# Altium project UZ_per_cb_upgrade.PrjPcb (part 1 of 3)
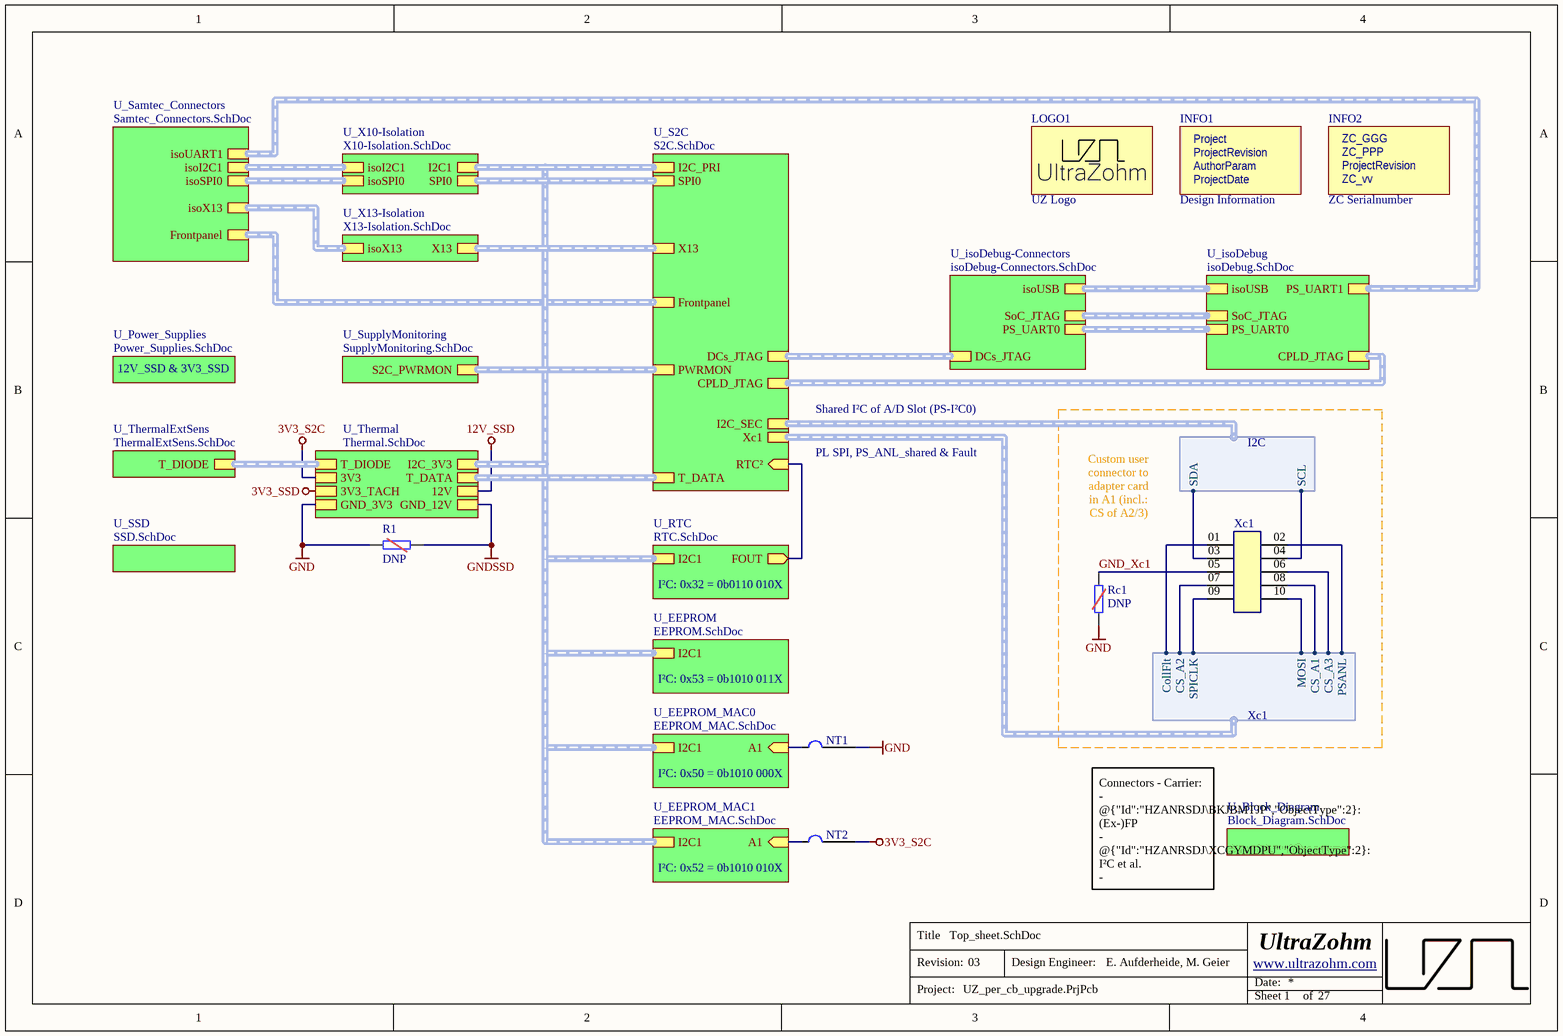
[diagram p0: Top_sheet.SchDoc]
AuthorParam: E. Aufderheide, M. Geier; Project: Rev04UZC_I²C&SSD&S²C; ProjectDate: 05/2025; ProjectRevision: 03; ZC_GGG: 004; ZC_PPP: 003; SheetTotal: 27; Organization: UltraZohm; Website: www.ultrazohm.com
21 sheets, 223 parts. Net scope: hierarchical (ports join the sheet entries above them; power ports are global).
Board file: UZ_per_cb_upgrade.PcbDoc
Sheets:
  Top_sheet.SchDoc
    U_Samtec_Connectors = Samtec_Connectors.SchDoc
    U_RTC = RTC.SchDoc
    U_EEPROM_MAC0 = EEPROM_MAC.SchDoc
    U_EEPROM_MAC1 = EEPROM_MAC.SchDoc
    U_EEPROM = EEPROM.SchDoc
    U_SSD = SSD.SchDoc
    U_Block_Diagram = Block_Diagram.SchDoc
    U_Power_Supplies = Power_Supplies.SchDoc
    U_S2C = S2C.SchDoc
      U_S2C_IOs3V3 = S2C_IOs3V3.SchDoc
        U_S2C_IOs3V3_SelectSPI = S2C_IOs3V3_SelectSPI.SchDoc
      U_S2C_IOs1V8 = S2C_IOs1V8.SchDoc
      U_S2C_IOsVIO = S2C_IOsVIO.SchDoc
      U_S2C_FrontpanelInterface = S2C_FrontpanelInterface.SchDoc
      U_S2C_SelectJTAG = S2C_SelectJTAG.SchDoc
    U_isoDebug-Connectors = isoDebug-Connectors.SchDoc
    U_X10-Isolation = X10-Isolation.SchDoc
    U_X13-Isolation = X13-Isolation.SchDoc
    U_SupplyMonitoring = SupplyMonitoring.SchDoc
    U_ThermalExtSens = ThermalExtSens.SchDoc
  isoDebug-Isolation.SchDoc

## Sheet Top_sheet.SchDoc
size A4; SheetNumber: 1

### Parts
INFO1  Design Information  [Design_info2]  (no BOM)
INFO2  ZC Serialnumber  [ZC-Serial]  (no BOM)
LOGO1  UZ Logo  [UZ_Logo_small]  (no BOM)
NT1  Net Tie 1 to 1  [1_to_1_NetTie_0.1mm]  (value not drawn)  (net tie, no BOM)
NT2  Net Tie 1 to 1  [1_to_1_NetTie_0.1mm]  (value not drawn)  (net tie, no BOM)
R1  DNP  [R_1206_TE-DNP]  (no BOM)
Rc1  DNP  [R_1206_TE-DNP]  (no BOM)
Xc1  PH 0.1" SMD 2x05  [TSM-105-01-L-DV]  (value not drawn)

### Sub-sheets
U_Block_Diagram = Block_Diagram.SchDoc: no entries
U_EEPROM = EEPROM.SchDoc: I2C1 (harness I2C)
U_EEPROM_MAC0 = EEPROM_MAC.SchDoc: I2C1 (harness I2C), A1 (in)
U_EEPROM_MAC1 = EEPROM_MAC.SchDoc: I2C1 (harness I2C), A1 (in)
U_isoDebug = isoDebug.SchDoc (file not in this document): SoC_JTAG (harness JTAG), CPLD_JTAG (harness JTAG), PS_UART0 (harness UART), PS_UART1 (harness UART), isoUSB (harness USB)  | SubSheet_SheetNumber: 20
U_isoDebug-Connectors = isoDebug-Connectors.SchDoc: isoUSB (harness USB), SoC_JTAG (harness JTAG), PS_UART0 (harness UART), DCs_JTAG (harness JTAG)
U_Power_Supplies = Power_Supplies.SchDoc: no entries
U_RTC = RTC.SchDoc: I2C1 (harness I2C), FOUT (out)
U_S2C = S2C.SchDoc: T_DATA (harness T_DATA), PWRMON (harness S2C_PWRMON), CPLD_JTAG (harness JTAG), DCs_JTAG (harness JTAG), I2C_PRI (harness I2C), Frontpanel (harness Frontpanel), SPI0 (harness SPI0), X13 (harness X13), I2C_SEC (harness I2C), Xc1 (harness Xc1), RTC² (in)
U_Samtec_Connectors = Samtec_Connectors.SchDoc: Frontpanel (harness Frontpanel), isoUART1 (harness UART), isoI2C1 (harness I2C), isoX13 (harness X13), isoSPI0 (harness SPI0)
U_SSD = SSD.SchDoc: no entries
U_SupplyMonitoring = SupplyMonitoring.SchDoc: S2C_PWRMON (harness S2C_PWRMON)
U_Thermal = Thermal.SchDoc (file not in this document): I2C_3V3 (harness I2C), T_DIODE (harness T_DIODE), T_DATA (harness T_DATA), 12V, 3V3, 3V3_TACH, GND_3V3, GND_12V  | SubSheet_SheetNumber: 25
U_ThermalExtSens = ThermalExtSens.SchDoc: T_DIODE (harness T_DIODE)
U_X10-Isolation = X10-Isolation.SchDoc: isoI2C1 (harness I2C), isoSPI0 (harness SPI0), I2C1 (harness I2C), SPI0 (harness SPI0)
U_X13-Isolation = X13-Isolation.SchDoc: isoX13 (harness X13), X13 (harness X13)

### Harnesses
I2C: SCL, SDA
Xc1: CollFlt, CS_A2, SPICLK, MOSI, CS_A1, CS_A3, PSANL

### Nets
3V3_S2C: NT2.2 ; sheet U_Thermal/3V3
GND: NT1.2 R1.2 Rc1.2 ; sheet U_Thermal/GND_3V3
GNDSSD: R1.1 ; sheet U_Thermal/GND_12V
EEPROM_MAC_A1-: NT1.1 ; sheet U_EEPROM_MAC0/A1
EEPROM_MAC_A1-: NT2.1 ; sheet U_EEPROM_MAC1/A1  [a separate net that carries the same name]
FOUT: sheet U_RTC/FOUT, sheet U_S2C/RTC²
GND_Xc1: Rc1.1 Xc1.05
Xc1.CollFlt: Xc1.01 ; sheet U_S2C/Xc1.CollFlt
Xc1.CS_A1: Xc1.08 ; sheet U_S2C/Xc1.CS_A1
Xc1.CS_A2: Xc1.07 ; sheet U_S2C/Xc1.CS_A2
Xc1.CS_A3: Xc1.06 ; sheet U_S2C/Xc1.CS_A3
Xc1.MOSI: Xc1.10 ; sheet U_S2C/Xc1.MOSI
Xc1.PSANL: Xc1.02 ; sheet U_S2C/Xc1.PSANL
Xc1.SPICLK: Xc1.09 ; sheet U_S2C/Xc1.SPICLK
NetR31_1: Xc1.04 ; sheet U_S2C/I2C_SEC.SCL
NetR32_1: Xc1.03 ; sheet U_S2C/I2C_SEC.SDA

### Buses and harness runs
harness sheet U_EEPROM/I2C1 = sheet U_EEPROM_MAC0/I2C1 = sheet U_EEPROM_MAC1/I2C1 = sheet U_RTC/I2C1 = sheet U_S2C/I2C_PRI = sheet U_Thermal/I2C_3V3 = sheet U_X10-Isolation/I2C1
harness sheet U_isoDebug-Connectors/DCs_JTAG = sheet U_S2C/DCs_JTAG
harness sheet U_isoDebug-Connectors/isoUSB = sheet U_isoDebug/isoUSB
harness sheet U_isoDebug-Connectors/PS_UART0 = sheet U_isoDebug/PS_UART0
harness sheet U_isoDebug-Connectors/SoC_JTAG = sheet U_isoDebug/SoC_JTAG
harness sheet U_isoDebug/CPLD_JTAG = sheet U_S2C/CPLD_JTAG
harness sheet U_isoDebug/PS_UART1 = sheet U_Samtec_Connectors/isoUART1
harness sheet U_S2C/Frontpanel = sheet U_Samtec_Connectors/Frontpanel
harness sheet U_S2C/PWRMON = sheet U_SupplyMonitoring/S2C_PWRMON
harness sheet U_S2C/SPI0 = sheet U_X10-Isolation/SPI0
harness sheet U_S2C/T_DATA = sheet U_Thermal/T_DATA
harness sheet U_S2C/X13 = sheet U_X13-Isolation/X13
harness sheet U_Samtec_Connectors/isoI2C1 = sheet U_X10-Isolation/isoI2C1
harness sheet U_Samtec_Connectors/isoSPI0 = sheet U_X10-Isolation/isoSPI0
harness sheet U_Samtec_Connectors/isoX13 = sheet U_X13-Isolation/isoX13
harness sheet U_Thermal/T_DIODE = sheet U_ThermalExtSens/T_DIODE

### Notes on the sheet
- 12V_SSD & 3V3_SSD
- Shared I²C of A/D Slot (PS-I²C0)
- PL SPI, PS_ANL_shared & Fault
- Custom user connector to adapter card in A1 (incl.: CS of A2/3)
- I²C: 0x32 = 0b0110 010X
- I²C: 0x53 = 0b1010 011X
- (near NT1) I²C: 0x50 = 0b1010 000X
- (near NT2) I²C: 0x52 = 0b1010 010X
- Connectors - Carrier:
  - @{"Id":"HZANRSDJ\BKJBMTJP","ObjectType":2}: (Ex-)FP
  - @{"Id":"HZANRSDJ\XCGYMDPU","ObjectType":2}: I²C et al.
  - @{"Id":"NFRUWTDK\GEDVIQXD","ObjectType":2}: D5 signals
  - @{"Id":"HZANRSDJ\LVDAVBXZ","ObjectType":2}: isoGPIO
  - 2x JTAG, 2x SATA
  NB: @{"Id":"NFRUWTDK\GEDVIQXD","ObjectType":2} sources
  the local @{"Id":"LAOQKLBU\YLFQDURX","ObjectType":1}!
- Title
- Revision:
- Design Engineer:
- Date:
- Project:
- Sheet
- of
- (in symbol Design Information) Project; ProjectRevision; AuthorParam; ProjectDate
- (in symbol ZC-Serial) ZC_GGG; ZC_PPP; ProjectRevision; ZC_vv

### Library data of the parts
INFO1 = Design Information: Manufacturer: UltraZohm; Created from: MGremer; Manufacturer Part Number: Design Information; PartID: 12; Created On: 03/11/2021 09:04:23; ComponentLink1Description: https://docs.ultrazohm.com/; ComponentLink1URL: homepage; Component Type: Design Information; Last Updated: 15/04/2025 09:29:36; Supplier 1: -; Supplier Part Number 1: -; Type: Design Information; Value: Design Information; Live Cycle Status: 1
INFO2 = ZC-Serial: Manufacturer: UltraZohm; Value: GGG-PPP-VVvv; Created from: FRosner; Manufacturer Part Number: ZC-Serial; PartID: 58; Created On: 15/04/2025 09:17:14; ComponentLink1Description: https://docs.ultrazohm.com/; ComponentLink1URL: homepage; Component Type: ZC Serialnumber; Last Updated: 15/04/2025 09:17:14; Supplier 1: -; Supplier Part Number 1: -; Type: Serial Number; Live Cycle Status: 1
LOGO1 = Logo small: Manufacturer: UltraZohm; Created from: MGremer; Created: Jan2021_Liegmann; Value: Logo; Manufacturer Part Number: Logo small; PartID: 10; Created On: 03.11.2021 09:04:23; ComponentLink1Description: https://docs.ultrazohm.com/; ComponentLink1URL: homepage; Component Type: Logo; Last Updated: 03.11.2021 09:05:50; Supplier 1: -; Supplier Part Number 1: -; Type: Logo; Live Cycle Status: 1
NT1 NT2 = Net Tie 1 to 1: Net Tie 1 to 1. Joins two nets without producing a DRC error or renaming one of the nets; PartID: 2; Created On: 29/09/2024 15:25:00; Component Type: Net Tie 1 to 1; Last Updated: 29/09/2024 15:25:00; Type: Net Tie (No BOM); Created by: MGeier; Live Cycle Status: 1
R1 Rc1 = UZgen_R_1206_DNP: Generic resistor (DNP); Manufacturer: UZgen; Created from: UZgenTool; Manufacturer Part Number: UZgen_R_1206_DNP; PartID: 595; Created On: 25/03/2025 14:26:15; Value: DNP; Device Package: 1206; Tolerance: -; Mounting Type: SMD; Last Updated: 02/04/2025 19:05:00
Xc1 = UZgen_Conn_PinHead_2x05_SMD_100mil_90deg: 0.1" Double-row Pin Header, 90°-to-PCB SMD, 2x05 Pins, 250V, 3A; Manufacturer: UZgen; Pin Pitch: 0.1" x 0.1"; Pin Orientation: 90° (standing); Created from: UZgenTool; Manufacturer Part Number: UZgen_Conn_PinHead_2x05_SMD_100mil_90deg; PartID: 4; Created On: 18/02/2025 11:27:30; Value: PH 0.1" SMD 2x05; Device Package: SMD 0.1" 2x05; Pin Count: 10; Pin Layout: 2x05; Pin Voltage: 250V; Pin Current: 3A; Mounting Type: SMD; Last Updated: 18/02/2025 11:27:30

## Sheet Samtec_Connectors.SchDoc
size A4; SheetNumber: 2
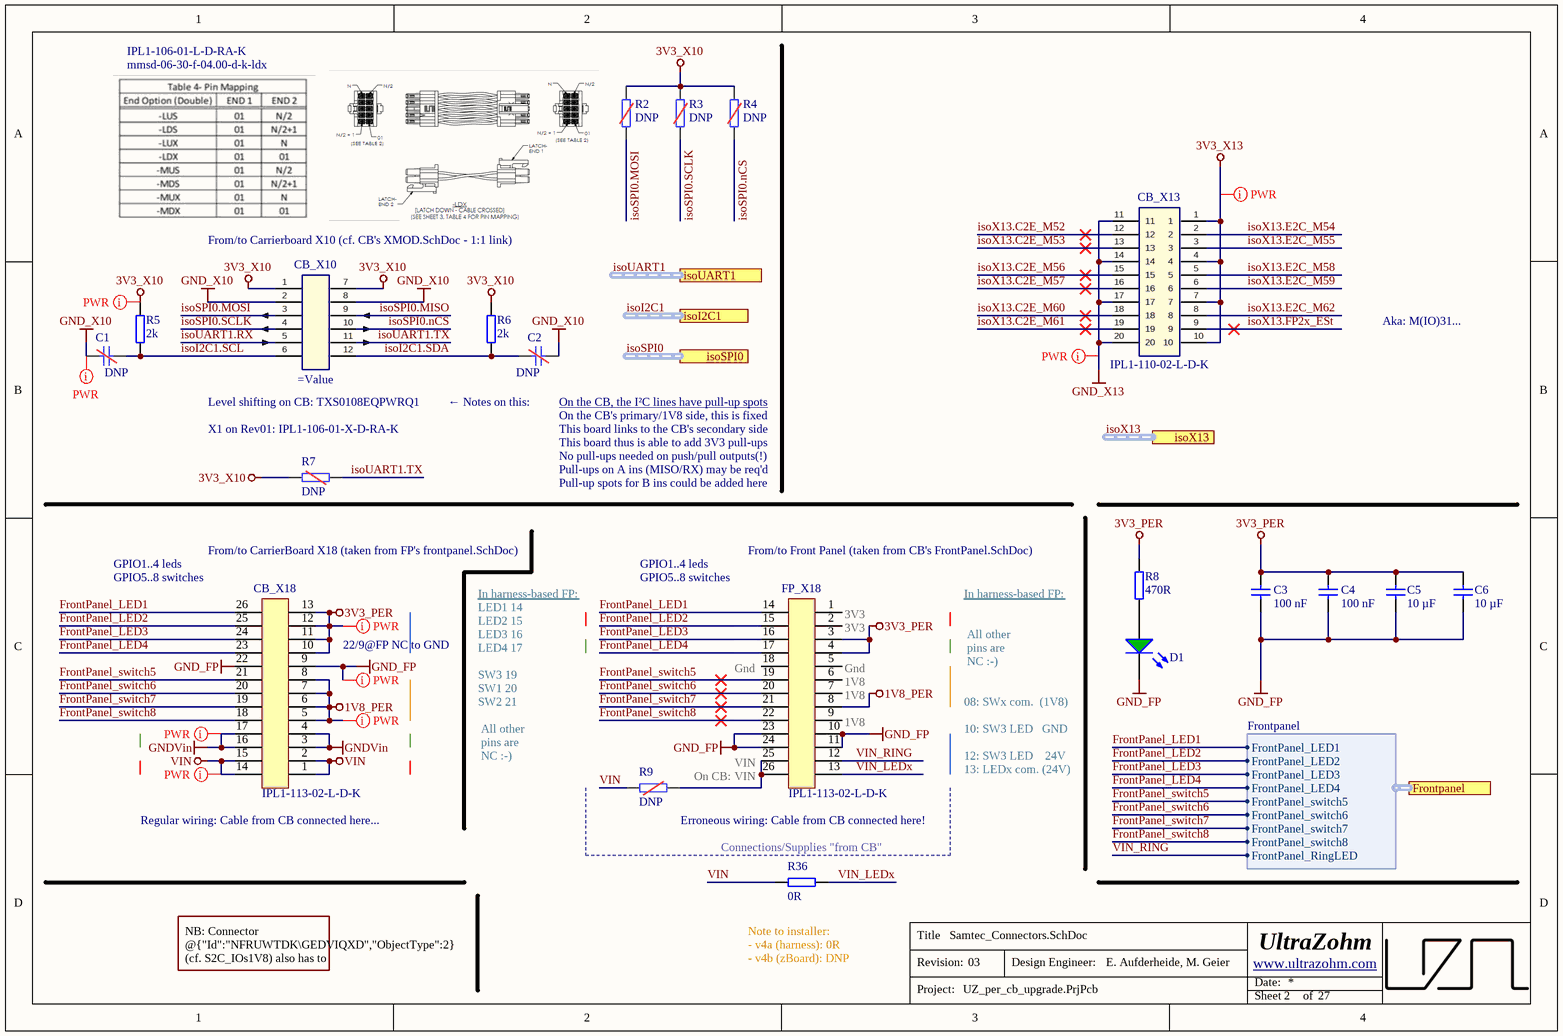
[diagram p1: Samtec_Connectors.SchDoc]

### Parts
C1  DNP  [C_0603_TE-DNP]  (no BOM)
C2  DNP  [C_0603_TE-DNP]  (no BOM)
C3  100 nF  [C_0603_TE]
C4  100 nF  [C_0603_TE]
C5  10 µF  [C_1206_TE]
C6  10 µF  [C_1206_TE]
CB_X10  (no value)  [IPL1-106-02-L-D-K]
CB_X13  IPL1-110-02-L-D-K  [IPL1-110-02-L-D-K]
CB_X18  IPL1-113-02-L-D-K  [IPL1-113-02-L-D-K]
D1  LED Green  [WL-SMCW_0603]  (value not drawn)
FP_X18  IPL1-113-02-L-D-K  [IPL1-113-02-L-D-K]
R2  DNP  [R_0603_TE-DNP]  (no BOM)
R3  DNP  [R_0603_TE-DNP]  (no BOM)
R4  DNP  [R_0603_TE-DNP]  (no BOM)
R5  2k  [R_0603_TE]
R6  2k  [R_0603_TE]
R7  DNP  [R_0603_TE-DNP]  (no BOM)
R8  470R  [R_0603_TE]
R9  DNP  [R_0603_TE-DNP]  (no BOM)
R36  0R  [R_0603_TE]

### Ports
Frontpanel (harness Frontpanel), isoI2C1 (harness I2C), isoSPI0 (harness SPI0), isoUART1 (harness UART), isoX13 (harness X13)

### Harnesses
Frontpanel: FrontPanel_LED1, FrontPanel_LED2, FrontPanel_LED3, FrontPanel_LED4, FrontPanel_switch5, FrontPanel_switch6, FrontPanel_switch7, FrontPanel_switch8, FrontPanel_RingLED

### Nets
1V8_PER: CB_X18.5 CB_X18.6 CB_X18.7 CB_X18.8 FP_X18.8
3V3_PER: C3.1 C4.1 C5.2 C6.2 CB_X18.10 CB_X18.11 CB_X18.12 CB_X18.13 FP_X18.3 FP_X18.4 R8.2
3V3_X10: CB_X10.1 CB_X10.7 R2.2 R3.2 R4.2 R5.2 R6.2 R7.2
3V3_X13: CB_X13.1 CB_X13.4 CB_X13.7 CB_X13.10
GND_FP: C3.2 C4.2 C5.1 C6.1 CB_X18.9 CB_X18.22 D1.1(K) FP_X18.10 FP_X18.11 FP_X18.23 FP_X18.24
GND_X10: C1.1 C2.2 CB_X10.2 CB_X10.8
GND_X13: CB_X13.11 CB_X13.14 CB_X13.17 CB_X13.20
GNDVin: CB_X18.3 CB_X18.4 CB_X18.16 CB_X18.17
VIN: CB_X18.1 CB_X18.2 CB_X18.14 CB_X18.15 R9.1 R36.1
FrontPanel_LED1: CB_X18.26 FP_X18.14 ; port Frontpanel.FrontPanel_LED1  [project net FP.FrontPanel_LED1]
FrontPanel_LED2: CB_X18.25 FP_X18.15 ; port Frontpanel.FrontPanel_LED2  [project net FP.FrontPanel_LED2]
FrontPanel_LED3: CB_X18.24 FP_X18.16 ; port Frontpanel.FrontPanel_LED3  [project net FP.FrontPanel_LED3]
FrontPanel_LED4: CB_X18.23 FP_X18.17 ; port Frontpanel.FrontPanel_LED4  [project net FP.FrontPanel_LED4]
FrontPanel_switch5: CB_X18.21 FP_X18.19 ; port Frontpanel.FrontPanel_switch5  [project net FP.FrontPanel_switch5]
FrontPanel_switch6: CB_X18.20 FP_X18.20 ; port Frontpanel.FrontPanel_switch6  [project net FP.FrontPanel_switch6]
FrontPanel_switch7: CB_X18.19 FP_X18.21 ; port Frontpanel.FrontPanel_switch7  [project net FP.FrontPanel_switch7]
FrontPanel_switch8: CB_X18.18 FP_X18.22 ; port Frontpanel.FrontPanel_switch8  [project net FP.FrontPanel_switch8]
isoI2C1.SCL: C1.2 CB_X10.6 R5.1
isoI2C1.SDA: C2.1 CB_X10.12 R6.1
isoSPI0.MISO: CB_X10.9
isoSPI0.MOSI: CB_X10.3 R2.1
isoSPI0.nCS: CB_X10.10 R4.1
isoSPI0.SCLK: CB_X10.4 R3.1
isoUART1.RX: CB_X10.5
isoUART1.TX: CB_X10.11 R7.1
isoX13.C2E_M52: CB_X13.12
isoX13.C2E_M53: CB_X13.13
isoX13.C2E_M56: CB_X13.15
isoX13.C2E_M57: CB_X13.16
isoX13.C2E_M60: CB_X13.18
isoX13.C2E_M61: CB_X13.19
isoX13.E2C_M54: CB_X13.2
isoX13.E2C_M55: CB_X13.3
isoX13.E2C_M58: CB_X13.5
isoX13.E2C_M59: CB_X13.6
isoX13.E2C_M62: CB_X13.8
isoX13.FP2x_ESt: CB_X13.9
VIN_LEDx: FP_X18.13 R36.2
VIN_RING: FP_X18.12 ; port Frontpanel.FrontPanel_RingLED  [project net FP.FrontPanel_RingLED]
NetD1_2: D1.2(A) R8.1
NetFP_X18_25: FP_X18.25 FP_X18.26 R9.2

Not connected (* = marked no-connect by the designer): FP_X18 1 2 5 6 7 9 18

### Buses and harness runs
harness isoI2C1 = port isoI2C1
harness isoSPI0 = port isoSPI0
harness isoUART1 = port isoUART1
harness isoX13 = port isoX13

### Layout directives
net class PWR: 1V8_PER, 3V3_PER, 3V3_X10, 3V3_X13, GND_FP, GND_X10, GND_X13, GNDVin, VIN

### Notes on the sheet
- IPL1-106-01-L-D-RA-K
- mmsd-06-30-f-04.00-d-k-ldx
- (near CB_X10) From/to Carrierboard X10 (cf. CB's XMOD.SchDoc - 1:1 link)
- Aka: M(IO)31...
- (near CB_X10) Level shifting on CB: TXS0108EQPWRQ1
- (near R7) X1 on Rev01: IPL1-106-01-X-D-RA-K
- ← Notes on this:
- (near C2) On the CB, the I²C lines have pull-up spots <https://bitbucket.org/ultrazohm/uz_carrierboard/issues/126/#comment-66924528>
- On the CB's primary/1V8 side, this is fixed
- This board links to the CB's secondary side
- This board thus is able to add 3V3 pull-ups
- No pull-ups needed on push/pull outputs(!)
- Pull-ups on A ins (MISO/RX) may be req'd
- Pull-up spots for B ins could be added here
- (near CB_X18) GPIO5..8 switches
- GPIO1..4 leds
- From/to CarrierBoard X18 (taken from FP's frontpanel.SchDoc)
- (near FP_X18) GPIO5..8 switches
- From/to Front Panel (taken from CB's FrontPanel.SchDoc)
- 22/9@FP NC to GND
- In harness-based FP:
  LED1	14
  LED2	15
  LED3	16
  LED4	17
  SW3	19
  SW1	20
  SW2	21
  All other
  pins are
  NC :-)
- (near R9) On CB:
- (near FP_X18) Gnd
  VIN
  VIN
- (near FP_X18) 3V3
  3V3
  Gnd
  1V8
  1V8
  1V8
- In harness-based FP:
  All other
  pins are
  NC :-)
  08: SWx com.  (1V8)
  10: SW3 LED   GND
  12: SW3 LED    24V
  13: LEDx com. (24V)
- (near CB_X18) Regular wiring: Cable from CB connected here...
- Erroneous wiring: Cable from CB connected here!
- (near R36) Connections/Supplies "from CB"
- NB: Connector @{"Id":"NFRUWTDK\GEDVIQXD","ObjectType":2} (cf. S2C_IOs1V8) also has to be linked to carrier at all times!
- (near R36) Note to installer:
  - v4a (harness): 0R
  - v4b (zBoard): DNP
- Title
- Revision:
- Design Engineer:
- Date:
- Project:
- Sheet
- of

### Library data of the parts
C1 C2 = UZgen_C_0603_DNP: Generic capacitor (DNP); Manufacturer: UZgen; Created from: UZgenTool; Manufacturer Part Number: UZgen_C_0603_DNP; PartID: 5812; Created On: 29/03/2025 17:15:00; Value: DNP; Device Package: 0603; Voltage: -; Technology: -; Tolerance: -; Mounting Type: SMD; Last Updated: 02/04/2025 19:05:00
C3 C4 = UZgen_C_0603_100nF_50V_X7R: Generic capacitor; Manufacturer: UZgen; Tolerance: 10 %; Voltage: 50V; Created from: AGeiger; Technology: X7R; Value: 100 nF; Manufacturer Part Number: UZgen_C_0603_100nF_50V_X7R; PartID: 1; Created On: 02/07/2024 14:42:23; Device Package: 0603; Mounting Type: SMD; Last Updated: 08/08/2024 15:01:15
C5 C6 = UZgen_C_1206_10uF_50V_X7R: Generic capacitor; Manufacturer: UZgen; Tolerance: 10 %; Voltage: 50V; Created from: MGeier; Value: 10 µF; Manufacturer Part Number: UZgen_C_1206_10uF_50V_X7R; PartID: 5807; Created On: 20/03/2025 14:05:00; Device Package: 1206; Technology: X7R; Mounting Type: SMD; Last Updated: 20/03/2025 14:05:00
CB_X10 = IPL1-106-02-L-D-K: Headers & Wire Housings .100" Mini Mate Isolated Power Terminal Header; Manufacturer: SAMTEC; Created from: AGeiger; Value: IPL1-106-02-L-D-K; Manufacturer Part Number: IPL1-106-02-L-D-K; PartID: 29; Created On: 08/04/2024 08:26:00; ComponentLink1Description: Datasheet; ComponentLink1URL: https://www.mouser.de/datasheet/2/527/ipl1-2854487.pdf; Last Updated: 30/04/2024 09:35:24; Mounting Type: SMD; Operating Temperature: -55 °C to +125 °C; Series: IPL1; Supplier 1: Mouser; Supplier Part Number 1: 200-IPL110602LDK; Supplier 2: LCSC; Supplier Part Number 2: C3032298; LCSC Part Number: C3032298
CB_X13 = IPL1-110-02-L-D-K: 2.54 mm Double Row Termin Assembly (SMD); Manufacturer: SAMTEC; Created from: MGremer; Number of positions: 10; Manufacturer Part Number: IPL1-110-02-L-D-K; PartID: 21; Created On: 30/11/2020 10:38:50; ComponentLink1Description: Homepage; ComponentLink1URL: https://www.samtec.com/products/ipl1; Component Type: Samtec Connector; Device Package: Connector; Last Updated: 01/04/2025 14:15:00; Mounting Type: THT; Supplier 1: SAMTEC; Supplier Part Number 1: IPL1-110-02-L-D-K; Supplier 2: Digi-Key; Supplier Part Number 2: SAM10586-ND; Supplier 3: LCSC; Supplier Part Number 3: C7544188; Type: Connector; Live Cycle Status: 1; Number of rows: 2; Stock number: not stored; LCSC Part Number: C7544188
CB_X18 FP_X18 = IPL1-113-02-L-D-K: 2.54 mm Double Row Termin Assembly (SMD); Manufacturer: SAMTEC; AN: 30828; Mixed: SMT; Temperature-Range: -55/+125; Extra: Connector Header IPL1, 2-row 26pos, key polarization, SMT 0°; Created from: MGremer; Number of positions: 13; Case: IPL1; HelpURL: b:\AD\adlib\datasheet\Samtec\IPL1-SMT\; H-ART: IPL1-113-02-L-D-K; Manufacturer Part Number: IPL1-113-02-L-D-K; PartID: 51; Created On: 30/11/2020 10:38:50; ComponentLink1Description: Homepage; ComponentLink1URL: https://www.samtec.com/products/ipl1; Component Type: Samtec Connector; Device Package: Connector; Last Updated: 25/01/2024 19:16:44; Mounting Type: SMD; Supplier 1: SAMTEC; Supplier Part Number 1: IPL1-113-02-L-D-K; Type: Connector; Live Cycle Status: 1; Number of rows: 2; LCSC Part Number: C5290052; Stock number: not stored
D1 = UZgen_LED_0603_Green: Standard LEDs - SMD 0603 green; Manufacturer: UZgen; Created from: UZgenTool; ComponentLink1Description: N/A; ComponentLink1URL: N/A; Value: LED Green; Supplier 1: LCSC; Supplier Part Number 1: =LCSC Part Number; Manufacturer Part Number: UZgen_LED_0603_Green; PartID: 21; Created On: 09/09/2024 10:45:01; Component Type: LED Diode; Device Package: 0603; Last Updated: 09/09/2024 10:45:01; Mounting Type: SMD; Type: Standard; Live Cycle Status: 1; Stock number: not stored; Color: green
R2-R4 R7 R9 = UZgen_R_0603_DNP: Generic resistor (DNP); Manufacturer: UZgen; Created from: UZgenTool; Manufacturer Part Number: UZgen_R_0603_DNP; PartID: 593; Created On: 25/03/2025 14:26:15; Value: DNP; Device Package: 0603; Tolerance: -; Mounting Type: SMD; Last Updated: 02/04/2025 19:05:00
R5 R6 = UZgen_R_0603_2k: Generic resistor; Manufacturer: UZgen; Tolerance: 1 %; Created from: UZgenTool; Value: 2k; Manufacturer Part Number: UZgen_R_0603_2k; PartID: 228; Created On: 02/07/2024 17:29:49; Device Package: 0603; Mounting Type: SMD; Last Updated: 02/07/2024 17:29:49
R8 = UZgen_R_0603_470R: Generic resistor; Manufacturer: UZgen; Tolerance: 1 %; Created from: UZgenTool; Value: 470R; Manufacturer Part Number: UZgen_R_0603_470R; PartID: 213; Created On: 02/07/2024 17:29:49; Device Package: 0603; Mounting Type: SMD; Last Updated: 02/07/2024 17:29:49
R36 = UZgen_R_0603_0R: Generic resistor; Manufacturer: UZgen; Tolerance: 1 %; Created from: UZgenTool; Value: 0R; Manufacturer Part Number: UZgen_R_0603_0R; PartID: 581; Created On: 08/07/2024 14:34:30; Device Package: 0603; Mounting Type: SMD; Last Updated: 08/07/2024 14:34:30

## Sheet RTC.SchDoc
size A4; SheetNumber: 3
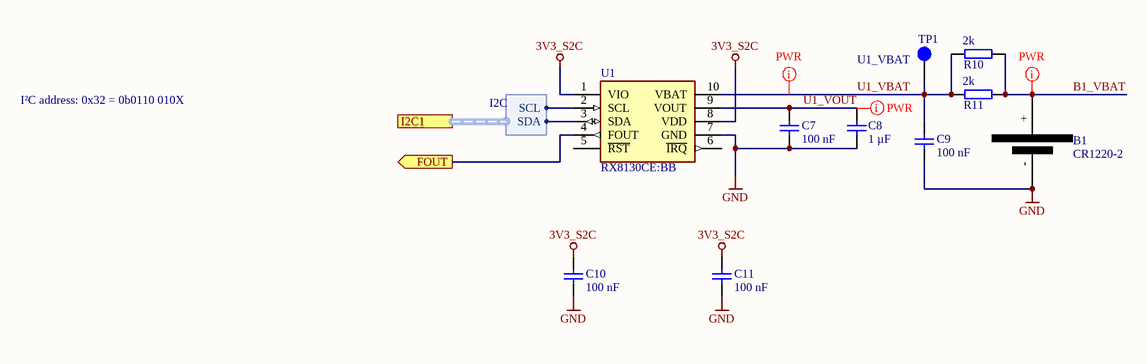
[diagram p2: RTC.SchDoc]

### Parts
B1  CR1220-2  [CR1220]
C7  100 nF  [C_0603_TE]
C8  1 µF  [C_0603_TE]
C9  100 nF  [C_0603_TE]
C10  100 nF  [C_0603_TE]
C11  100 nF  [C_0603_TE]
R10  2k  [R_0603_TE]
R11  2k  [R_0603_TE]
TP1  U1_VBAT  [TP_1mm]  (no BOM)
U1  RX8130CE:BB  [RX8130CE]

### Ports
FOUT (out), I2C1 (harness I2C)

### Harnesses
I2C: SCL, SDA

### Nets
3V3_S2C: C10.1 C11.1 U1.1(VIO) U1.8(VDD)
GND: B1.- C7.2 C8.1 C9.2 C10.2 C11.2 U1.7(GND)
B1_VBAT: B1.+ R10.2 R11.2
FOUT: U1.4(FOUT) ; port FOUT
U1_VBAT: C9.1 R10.1 R11.1 TP1.1 U1.10(VBAT)
U1_VOUT: C7.1 C8.2 U1.9(VOUT)
NetR25_1: U1.2(SCL) ; port I2C1.SCL
NetR30_1: U1.3(SDA) ; port I2C1.SDA

Not connected (* = marked no-connect by the designer): U1 5(~{RST}) 6(~{IRQ})

### Layout directives
net class PWR: B1_VBAT, U1_VBAT, U1_VOUT

### Notes on the sheet
- I²C address: 0x32 = 0b0110 010X
- Title
- Revision:
- Design Engineer:
- Date:
- Project:
- Sheet
- of

### Library data of the parts
B1 = CR1220-2: Battery base CR1220 SMD Button And Strip Battery Connector ROHS; Manufacturer: Q&J; Created from: FRosner; Manufacturer Part Number: CR1220-2; PartID: 36; Created On: 02/07/2024 19:17:25; ComponentLink1Description: Datasheet; ComponentLink1URL: https://wmsc.lcsc.com/wmsc/upload/file/pdf/v2/lcsc/2405081637_Q-J-CR1220-2_C70381.pdf; Component Type: Battery holder; Device Package: SMD; Last Updated: 23/08/2024 11:42:29; Mounting Type: SMD; Operating Temperature: -40 to +85 °C; Supplier 1: LCSC; Supplier Part Number 1: C70381; Type: Battery holder; Live Cycle Status: 1; LCSC Part Number: C70381; Stock number: not stored
C7 C9-C11 = UZgen_C_0603_100nF_50V_X7R: as C3 on sheet Samtec_Connectors; Technology: X7R; Value: 100 nF; Manufacturer Part Number: UZgen_C_0603_100nF_50V_X7R; PartID: 1; Created On: 02/07/2024 14:42:23; Device Package: 0603; Mounting Type: SMD; Last Updated: 08/08/2024 15:01:15
C8 = UZgen_C_0603_1uF_16V_X7R: Generic capacitor; Manufacturer: UZgen; Voltage: 16V; Tolerance: 10 %; Created from: UZgenTool; Manufacturer Part Number: UZgen_C_0603_1uF_16V_X7R; PartID: 3783; Created On: 02/08/2024 11:17:59; Value: 1 µF; Device Package: 0603; Technology: X7R; Mounting Type: SMD; Last Updated: 02/08/2024 11:17:59
R10 R11 = UZgen_R_0603_2k: as R5 on sheet Samtec_Connectors; Manufacturer Part Number: UZgen_R_0603_2k; PartID: 228; Created On: 02/07/2024 17:29:49; Value: 2k; Device Package: 0603; Mounting Type: SMD; Last Updated: 02/07/2024 17:29:49
TP1 = NULL: Testpoint 1mm; Manufacturer Part Number: NULL; Created from: AGeiger; Created: 2018_06_25_AGeiger; Value: U1_VBAT; PartID: 9; Created On: 20/09/2022 13:14:57; Component Type: Testpoint; Last Updated: 20/09/2022 13:15:39; Manufacturer: NULL; Supplier 1: NULL; Supplier Part Number 1: NULL; Type: Testpoint; Live Cycle Status: 1
U1 = RX8130CE:BB: I2C SMD-10P Real Time Clocks ROHS; Manufacturer: Seiko Epson; Value: 32.768 kHz; Created from: FRosner; Manufacturer Part Number: RX8130CE:BB; PartID: 4; Created On: 26/02/2025 10:16:06; ComponentLink1Description: Datasheet; ComponentLink1URL: https://www.lcsc.com/datasheet/lcsc_datasheet_2105222138_Seiko-Epson-RX8130CE-BB_C1542426.pdf; Component Type: Oscillator; Device Package: SMD-10P; Last Updated: 26/02/2025 10:16:06; Mounting Type: SMD; Operating Temperature: -40 to +85°C; Supplier 1: LCSC; Supplier Part Number 1: C1542426; LCSC Part Number: C1542426

## Sheet EEPROM_MAC.SchDoc
size A4; SheetNumber: 5
Used 2 times, as channels U_EEPROM_MAC0, U_EEPROM_MAC1. Parts and nets are listed once, with the designators drawn on the sheet.
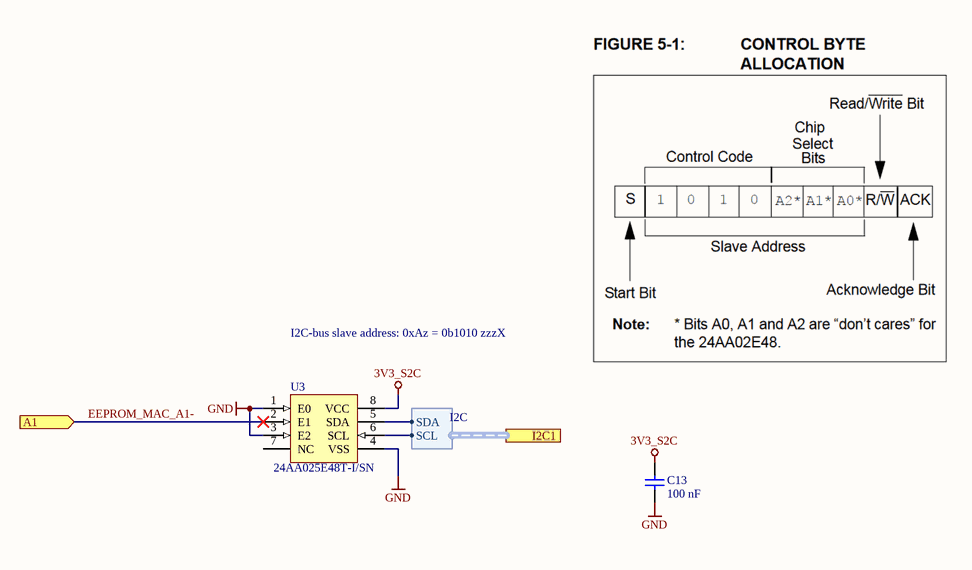
[diagram p3: EEPROM_MAC.SchDoc]

### Parts
C13  100 nF  [C_0603_TE]
U3  24AA025E48T-I/SN  [D0008A_N]

### Ports
A1 (in), I2C1 (harness I2C)

### Harnesses
I2C: SCL, SDA

### Nets
3V3_S2C: C13.1 U3.8(VCC)
GND: C13.2 U3.1(E0) U3.3(E2) U3.4(VSS)
EEPROM_MAC_A1-: U3.2(E1) ; port A1
NetU3_5: U3.5(SDA) ; port I2C1.SDA
NetU3_6: U3.6(SCL) ; port I2C1.SCL

Not connected (* = marked no-connect by the designer): U3 7(NC)

### Channels
U_EEPROM_MAC0: designators C13=C10A U3=U4A; ports A1=EEPROM_MAC_A1-
U_EEPROM_MAC1: designators C13=C10B U3=U4B; ports A1=EEPROM_MAC_A1-

### Notes on the sheet
- I2C-bus slave address: 0xAz = 0b1010 zzzX
- Title
- Revision:
- Design Engineer:
- Date:
- Project:
- Sheet
- of

### Library data of the parts
C13 = UZgen_C_0603_100nF_50V_X7R: as C3 on sheet Samtec_Connectors; Technology: X7R; Value: 100 nF; Manufacturer Part Number: UZgen_C_0603_100nF_50V_X7R; PartID: 1; Created On: 02/07/2024 14:42:23; Device Package: 0603; Mounting Type: SMD; Last Updated: 08/08/2024 15:01:15
U3 = 24AA025E48T-I/SN: 2Kbit I2C SOP-8 EEPROM ROHS; Manufacturer: Microchip Tech; Created from: FRosner; ComponentLink1Description: Datasheet; ComponentLink1URL: https://wmsc.lcsc.com/wmsc/upload/file/pdf/v2/lcsc/2202010930_Microchip-Tech-24AA025E48T-I-SN_C2060925.pdf; Manufacturer Part Number: 24AA025E48T-I/SN; PartID: 7; Created On: 07/09/2024 12:18:21; Component Type: EEPROM; Device Package: SOIC-8; Last Updated: 10/09/2024 09:33:15; Mounting Type: SMD; Operating Temperature: -40 to +85 °C; Series: 24AA025; Supplier 1: Mouser; Supplier Part Number 1: 579-24AA025E48T-I/SN; Supplier 2: LCSC; Supplier Part Number 2: C2060925; Type: Memory; Value: 24AA025E48T-I/SN; LCSC Part Number: C2060925

## Sheet EEPROM.SchDoc
size A4; SheetNumber: 4
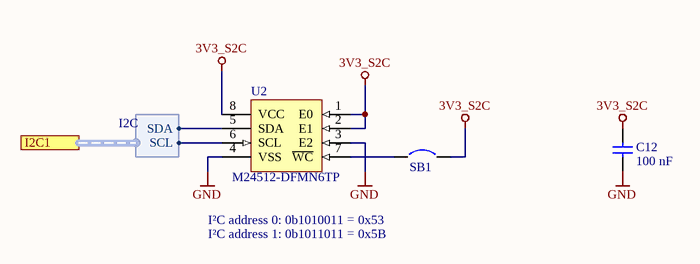
[diagram p4: EEPROM.SchDoc]

### Parts
C12  100 nF  [C_0603_TE]
SB1  Solder Bump 0603  [SB_0603]  (value not drawn)  (no BOM)
U2  M24512-DFMN6TP  [D0008A_N]

### Ports
I2C1 (harness I2C)

### Harnesses
I2C: SCL, SDA

### Nets
3V3_S2C: C12.1 SB1.2 U2.1(E0) U2.2(E1) U2.8(VCC)
GND: C12.2 U2.3(E2) U2.4(VSS)
NetR25_1: U2.6(SCL) ; port I2C1.SCL
NetR30_1: U2.5(SDA) ; port I2C1.SDA
NetSB1_1: SB1.1 U2.7(~{WC})

### Notes on the sheet
- I²C address 0: 0b1010011 = 0x53
- I²C address 1: 0b1011011 = 0x5B
- Title
- Revision:
- Design Engineer:
- Date:
- Project:
- Sheet
- of

### Library data of the parts
C12 = UZgen_C_0603_100nF_50V_X7R: as C3 on sheet Samtec_Connectors; Technology: X7R; Value: 100 nF; Manufacturer Part Number: UZgen_C_0603_100nF_50V_X7R; PartID: 1; Created On: 02/07/2024 14:42:23; Device Package: 0603; Mounting Type: SMD; Last Updated: 08/08/2024 15:01:15
SB1 = =Value: Created from: AGeiger; Revision: July-2002: Re-released for DXP Platform.; Manufacturer Part Number: Solder Bump 0603; PartID: 1; Created On: 09/01/2024 17:13:56; Component Type: Solder Bump; Device Package: 0603; Last Updated: 09/01/2024 17:13:56; Mounting Type: SMD; Value: Solder Bump 0603
U2 = M24512-DFMN6TP: 512Kbit 1MHz I2C SOP-8 EEPROM ROHS; Manufacturer: STMicroelectronics; Created from: FRosner; Manufacturer Part Number: M24512-DFMN6TP; PartID: 6; Created On: 07/09/2024 12:11:36; ComponentLink1Description: Datasheet; ComponentLink1URL: https://wmsc.lcsc.com/wmsc/upload/file/pdf/v2/lcsc/2304140030_STMicroelectronics-M24512-DFMN6TP_C222090.pdf; Component Type: EEPROM; Device Package: SOP-8; Last Updated: 07/09/2024 12:18:21; Mounting Type: SMD; Operating Temperature: -40 to +85 °C; Series: M24xxx; Supplier 1: Mouser; Supplier Part Number 1: 511-M24512-DFMN6TP; Supplier 2: LCSC; Supplier Part Number 2: C222090; Type: Memory; Value: M24512-DFMN6TP; LCSC Part Number: C222090

## Sheet SSD.SchDoc
size A4; SheetNumber: 6
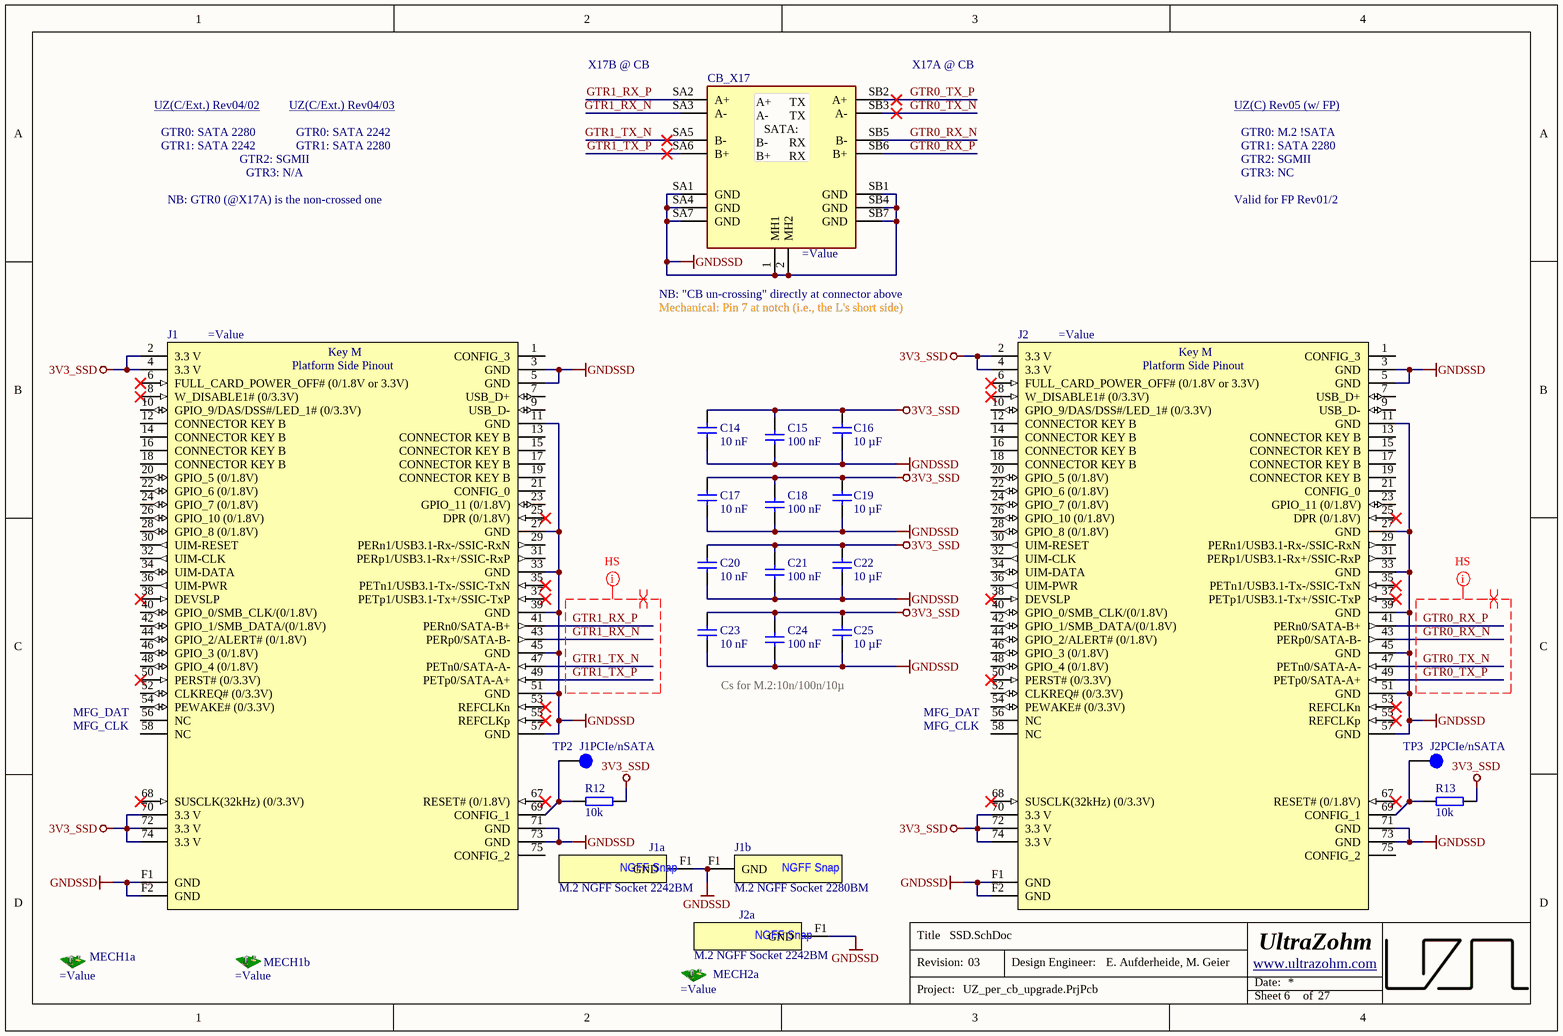
[diagram p5: SSD.SchDoc]

### Parts
C14  10 nF  [C_0603_TE]
C15  100 nF  [C_0603_TE]
C16  10 µF  [C_1206_TE]
C17  10 nF  [C_0603_TE]
C18  100 nF  [C_0603_TE]
C19  10 µF  [C_1206_TE]
C20  10 nF  [C_0603_TE]
C21  100 nF  [C_0603_TE]
C22  10 µF  [C_1206_TE]
C23  10 nF  [C_0603_TE]
C24  100 nF  [C_0603_TE]
C25  10 µF  [C_1206_TE]
CB_X17  (no value)  [XUTS-0722-2070]
J1  (no value)  [M.2-M-Key]
J1a  M.2 NGFF Socket 2242BM  [M.2-NGFF-Socket-2242BM]  (no BOM)
J1b  M.2 NGFF Socket 2280BM  [M.2-NGFF-Socket-2280BM]  (no BOM)
J2  (no value)  [M.2-M-Key]
J2a  M.2 NGFF Socket 2242BM  [M.2-NGFF-Socket-2242BM]  (no BOM)
MECH1a  (no value)  [WA-SMSI-2.5mm]
MECH1b  (no value)  [WA-SMSI-2.5mm]
MECH2a  (no value)  [WA-SMSI-2.5mm]
R12  10k  [R_0603_TE]
R13  10k  [R_0603_TE]
TP2  J1PCIe/nSATA  [TP_1mm]  (no BOM)
TP3  J2PCIe/nSATA  [TP_1mm]  (no BOM)

### Nets
3V3_SSD: C14.1 C15.1 C16.2 C17.1 C18.1 C19.2 C20.1 C21.1 C22.2 C23.1 C24.1 C25.2 J1.2(3.3_V) J1.4(3.3_V) J1.70(3.3_V) J1.72(3.3_V) J1.74(3.3_V) J2.2(3.3_V) J2.4(3.3_V) J2.70(3.3_V) J2.72(3.3_V) J2.74(3.3_V) R12.1 R13.1
GNDSSD: C14.2 C15.2 C16.1 C17.2 C18.2 C19.1 C20.2 C21.2 C22.1 C23.2 C24.2 C25.1 CB_X17.1(MH1) CB_X17.2(MH2) CB_X17.SA1(GND) CB_X17.SA4(GND) CB_X17.SA7(GND) CB_X17.SB1(GND) CB_X17.SB4(GND) CB_X17.SB7(GND) J1.3(GND) J1.5(GND) J1.11(GND) J1.27(GND) J1.33(GND) J1.39(GND) J1.45(GND) J1.51(GND) J1.57(GND) J1.71(GND) J1.73(GND) J1.F1(GND) J1.F2(GND) J1a.F1(GND) J1b.F1(GND) J2.3(GND) J2.5(GND) J2.11(GND) J2.27(GND) J2.33(GND) J2.39(GND) J2.45(GND) J2.51(GND) J2.57(GND) J2.71(GND) J2.73(GND) J2.F1(GND) J2.F2(GND) J2a.F1(GND)
GTR0_RX_N: CB_X17.SB5(B-) J2.43(PERp0/SATA-B-)
GTR0_RX_P: CB_X17.SB6(B+) J2.41(PERn0/SATA-B+)
GTR0_TX_N: CB_X17.SB3(A-) J2.47(PETn0/SATA-A-)
GTR0_TX_P: CB_X17.SB2(A+) J2.49(PETp0/SATA-A+)
GTR1_RX_N: CB_X17.SA3(A-) J1.43(PERp0/SATA-B-)
GTR1_RX_P: CB_X17.SA2(A+) J1.41(PERn0/SATA-B+)
GTR1_TX_N: CB_X17.SA5(B-) J1.47(PETn0/SATA-A-)
GTR1_TX_P: CB_X17.SA6(B+) J1.49(PETp0/SATA-A+)
NetJ1_69: J1.69(CONFIG_1) R12.2 TP2.1
NetJ2_69: J2.69(CONFIG_1) R13.2 TP3.1

Not connected (* = marked no-connect by the designer): J1 1(CONFIG_3) 6(FULL_CARD_POWER_OFF#_(0/1.8V_or_3.3V))* 7(USB_D+) 8(W_DISABLE1#_(0/3.3V))* 9(USB_D-) 10(GPIO_9/DAS/DSS#/LED_1#_(0/3.3V)) 12(CONNECTOR_KEY_B) 13(CONNECTOR_KEY_B) 14(CONNECTOR_KEY_B) 15(CONNECTOR_KEY_B) 16(CONNECTOR_KEY_B) 17(CONNECTOR_KEY_B) 18(CONNECTOR_KEY_B) 19(CONNECTOR_KEY_B) 20(GPIO_5_(0/1.8V)) 21(CONFIG_0) 22(GPIO_6_(0/1.8V)) 23(GPIO_11_(0/1.8V)) 24(GPIO_7_(0/1.8V)) 25(DPR_(0/1.8V))* 26(GPIO_10_(0/1.8V)) 28(GPIO_8_(0/1.8V)) 29(PERn1/USB3.1-Rx-/SSIC-RxN) 30(UIM-RESET) 31(PERp1/USB3.1-Rx+/SSIC-RxP) 32(UIM-CLK) 34(UIM-DATA) 35(PETn1/USB3.1-Tx-/SSIC-TxN)* 36(UIM-PWR) 37(PETp1/USB3.1-Tx+/SSIC-TxP)* 38(DEVSLP)* 40(GPIO_0/SMB_CLK/(0/1.8V)) 42(GPIO_1/SMB_DATA/(0/1.8V)) 44(GPIO_2/ALERT#_(0/1.8V)) 46(GPIO_3_(0/1.8V)) 48(GPIO_4_(0/1.8V)) 50(PERST#_(0/3.3V))* 52(CLKREQ#_(0/3.3V)) 53(REFCLKn)* 54(PEWAKE#_(0/3.3V)) 55(REFCLKp)* 56(NC) 58(NC) 67(RESET#_(0/1.8V))* 68(SUSCLK(32kHz)_(0/3.3V))* 75(CONFIG_2); J2 1(CONFIG_3) 6(FULL_CARD_POWER_OFF#_(0/1.8V_or_3.3V))* 7(USB_D+) 8(W_DISABLE1#_(0/3.3V))* 9(USB_D-) 10(GPIO_9/DAS/DSS#/LED_1#_(0/3.3V)) 12(CONNECTOR_KEY_B) 13(CONNECTOR_KEY_B) 14(CONNECTOR_KEY_B) 15(CONNECTOR_KEY_B) 16(CONNECTOR_KEY_B) 17(CONNECTOR_KEY_B) 18(CONNECTOR_KEY_B) 19(CONNECTOR_KEY_B) 20(GPIO_5_(0/1.8V)) 21(CONFIG_0) 22(GPIO_6_(0/1.8V)) 23(GPIO_11_(0/1.8V)) 24(GPIO_7_(0/1.8V)) 25(DPR_(0/1.8V))* 26(GPIO_10_(0/1.8V)) 28(GPIO_8_(0/1.8V)) 29(PERn1/USB3.1-Rx-/SSIC-RxN) 30(UIM-RESET) 31(PERp1/USB3.1-Rx+/SSIC-RxP) 32(UIM-CLK) 34(UIM-DATA) 35(PETn1/USB3.1-Tx-/SSIC-TxN)* 36(UIM-PWR) 37(PETp1/USB3.1-Tx+/SSIC-TxP)* 38(DEVSLP)* 40(GPIO_0/SMB_CLK/(0/1.8V)) 42(GPIO_1/SMB_DATA/(0/1.8V)) 44(GPIO_2/ALERT#_(0/1.8V)) 46(GPIO_3_(0/1.8V)) 48(GPIO_4_(0/1.8V)) 50(PERST#_(0/3.3V))* 52(CLKREQ#_(0/3.3V)) 53(REFCLKn)* 54(PEWAKE#_(0/3.3V)) 55(REFCLKp)* 56(NC) 58(NC) 67(RESET#_(0/1.8V))* 68(SUSCLK(32kHz)_(0/3.3V))* 75(CONFIG_2)

### Layout directives
differential pair: GTR0_RX_N, GTR0_RX_P, GTR0_TX_N, GTR0_TX_P, GTR1_RX_N, GTR1_RX_P, GTR1_TX_N, GTR1_TX_P
net class HS: GTR0_RX_N, GTR0_RX_P, GTR0_TX_N, GTR0_TX_P, GTR1_RX_N, GTR1_RX_P, GTR1_TX_N, GTR1_TX_P

### Notes on the sheet
- UZ(C/Ext.) Rev04/02
- UZ(C/Ext.) Rev04/03
- X17B @ CB
- X17A @ CB
- UZ(C) Rev05 (w/ FP)
- GTR0: SATA 2280
- GTR1: SATA 2242
- GTR2: SGMII
- GTR3: N/A
- GTR0: SATA 2242
- GTR1: SATA 2280
- (near CB_X17) A+      TX
  A-       TX
  SATA:
  B-       RX
  B+      RX
- GTR0: M.2 !SATA
- GTR3: NC
- NB: GTR0 (@X17A) is the non-crossed one
- Valid for FP Rev01/2
- (near CB_X17) NB: "CB un-crossing" directly at connector above
- Mechanical: Pin 7 at notch (i.e., the L's short side)
- (near J1) MFG_DAT
- Cs for M.2:10n/100n/10µ
- (near J2) MFG_DAT
- (near J1) MFG_CLK
- (near J2) MFG_CLK
- Title
- Revision:
- Design Engineer:
- Date:
- Project:
- Sheet
- of
- (in symbol 1-2199230-5) Key M; Platform Side Pinout
- (in symbol M.2 NGFF Socket 2242BM) NGFF Snap
- (in symbol M.2 NGFF Socket 2280BM) NGFF Snap

### Library data of the parts
C14 C17 C20 C23 = UZgen_C_0603_10nF_50V_X7R: Generic capacitor; Manufacturer: UZgen; Voltage: 50V; Tolerance: 10 %; Created from: UZgenTool; Technology: X7R; Value: 10 nF; Manufacturer Part Number: UZgen_C_0603_10nF_50V_X7R; PartID: 4263; Created On: 02/08/2024 11:18:09; Device Package: 0603; Mounting Type: SMD; Last Updated: 02/08/2024 11:18:09
C15 C18 C21 C24 = UZgen_C_0603_100nF_50V_X7R: as C3 on sheet Samtec_Connectors; Technology: X7R; Value: 100 nF; Manufacturer Part Number: UZgen_C_0603_100nF_50V_X7R; PartID: 1; Created On: 02/07/2024 14:42:23; Device Package: 0603; Mounting Type: SMD; Last Updated: 08/08/2024 15:01:15
C16 C19 C22 C25 = UZgen_C_1206_10uF_50V_X7R: as C5 on sheet Samtec_Connectors; Value: 10 µF; Manufacturer Part Number: UZgen_C_1206_10uF_50V_X7R; PartID: 5807; Created On: 20/03/2025 14:05:00; Device Package: 1206; Technology: X7R; Mounting Type: SMD; Last Updated: 20/03/2025 14:05:00
CB_X17 = XUTS-0722-2070: 1.27mm SATA Bend insert 14P -55℃~+105℃ Push-Pull,P=1.27mm Edgeboard Connectors ROHS; Manufacturer: Lian Xin Technology; Created from: FRosner; Manufacturer Part Number: XUTS-0722-2070; PartID: 44; Created On: 21/08/2024 13:19:35; ComponentLink1Description: Datasheet; ComponentLink1URL: https://wmsc.lcsc.com/wmsc/upload/file/pdf/v2/lcsc/2309271036_Lian-Xin-Technology-XUTS-0722-2070_C18202154.pdf; Last Updated: 10/09/2024 09:30:32; Mounting Type: THT; Operating Temperature: -55 °C to +85 °C; Supplier 1: LCSC; Supplier Part Number 1: C18202154; Value: XUTS-0722-2070; LCSC Part Number: C18202154
J1 J2 = 1-2199230-5: M.2 0.5mm Surface Mount 67 SMD,P=0.5mm Card Edge Connectors ROHS; Manufacturer: TE Connectivity; Created from: AGeiger; Manufacturer Part Number: 1-2199230-5; PartID: 12; Created On: 06/06/2023 08:54:40; ComponentLink1Description: Datasheet; ComponentLink1URL: https://www.mouser.de/datasheet/2/418/9/ENG_DS_1_1773702_1NGFFQRG_EN_0214_1_1773702_1NGFF_-3328389.pdf; Last Updated: 25/02/2025 09:18:43; Mounting Type: SMD; Operating Temperature: -40 °C to +80 °C; Series: M2; Supplier 1: LCSC; Supplier Part Number 1: C590854; Value: 1-2199230-5; LCSC Part Number: C590854
J1a J2a = M.2 NGFF Socket 2242BM: M.2 NGFF Socket 2242BM Snap; Manufacturer: n.a.; AN: 26334; Mixed: SMT; Extra: Variant of 25485; Created from: AGeiger; HelpURL: B:\AD\adlib\datasheet\1-2199119-0; Manufacturer Part Number: M.2 NGFF Socket 2242BM; PartID: 14; Created On: 06/06/2023 09:00:23; ComponentLink1Description: Datasheet; ComponentLink1URL: https://datasheet.lcsc.com/lcsc/2302021209_YIYUAN-SMTSOM325BTR_C5301784.pdf; Last Updated: 06/06/2023 09:04:37; Series: M2; Supplier 1: n.a.; Supplier Part Number 1: n.a.; Value: M.2 NGFF Socket 2242BM
J1b = M.2 NGFF Socket 2280BM: M.2 NGFF Socket 2280BM Snap; Manufacturer: n.a.; AN: 26274; Mixed: SMT; Extra: Variant of 25485; Created from: AGeiger; HelpURL: B:\AD\adlib\datasheet\1-2199119-0; Manufacturer Part Number: M.2 NGFF Socket 2280BM; PartID: 15; Created On: 06/06/2023 09:01:36; ComponentLink1Description: Datasheet; ComponentLink1URL: https://datasheet.lcsc.com/lcsc/2302021209_YIYUAN-SMTSOM325BTR_C5301784.pdf; Last Updated: 06/06/2023 09:04:37; Series: M2; Supplier 1: n.a.; Supplier Part Number 1: n.a.; Value: M.2 NGFF Socket 2280BM
MECH1a MECH1b MECH2a = SMTSOM325BTR: SMD Nut; Manufacturer: YIYUAN; AN: 32101; Mixed: THT; H-ART: 9774025360; Temperature-Range: -55/+150 (Abs); Extra: WA-SMSI; Created from: AGeiger; HelpURL: B:\AD\adlib\datasheet\WE_9774025360; LCSC Part #: C5301784; Manufacturer Part Number: SMTSOM325BTR; PartID: 13; Created On: 06/06/2023 08:57:00; ComponentLink1Description: Datasheet; ComponentLink1URL: https://datasheet.lcsc.com/lcsc/2302021209_YIYUAN-SMTSOM325BTR_C5301784.pdf; Last Updated: 06/06/2023 08:57:00; Mounting Type: SMD; Series: M2; Supplier 1: LCSC; Supplier Part Number 1: C5301784; Value: SMTSOM325BTR; LCSC Part Number: C5301784
R12 R13 = UZgen_R_0603_10k: Generic resistor; Manufacturer: UZgen; Tolerance: 1 %; Created from: AGeiger; Value: 10k; Manufacturer Part Number: UZgen_R_0603_10k; PartID: 1; Created On: 02/07/2024 14:34:53; Device Package: 0603; Mounting Type: SMD; Last Updated: 02/07/2024 14:37:16
TP2 TP3 = NULL: as TP1 on sheet RTC; Created: 2018_06_25_AGeiger; PartID: 9; Created On: 20/09/2022 13:14:57; Component Type: Testpoint; Last Updated: 20/09/2022 13:15:39; Manufacturer: NULL; Supplier 1: NULL; Supplier Part Number 1: NULL; Type: Testpoint; Live Cycle Status: 1
  TP2: Value: J1PCIe/nSATA
  TP3: Value: J2PCIe/nSATA

## Sheet Block_Diagram.SchDoc
size A4; SheetNumber: 27
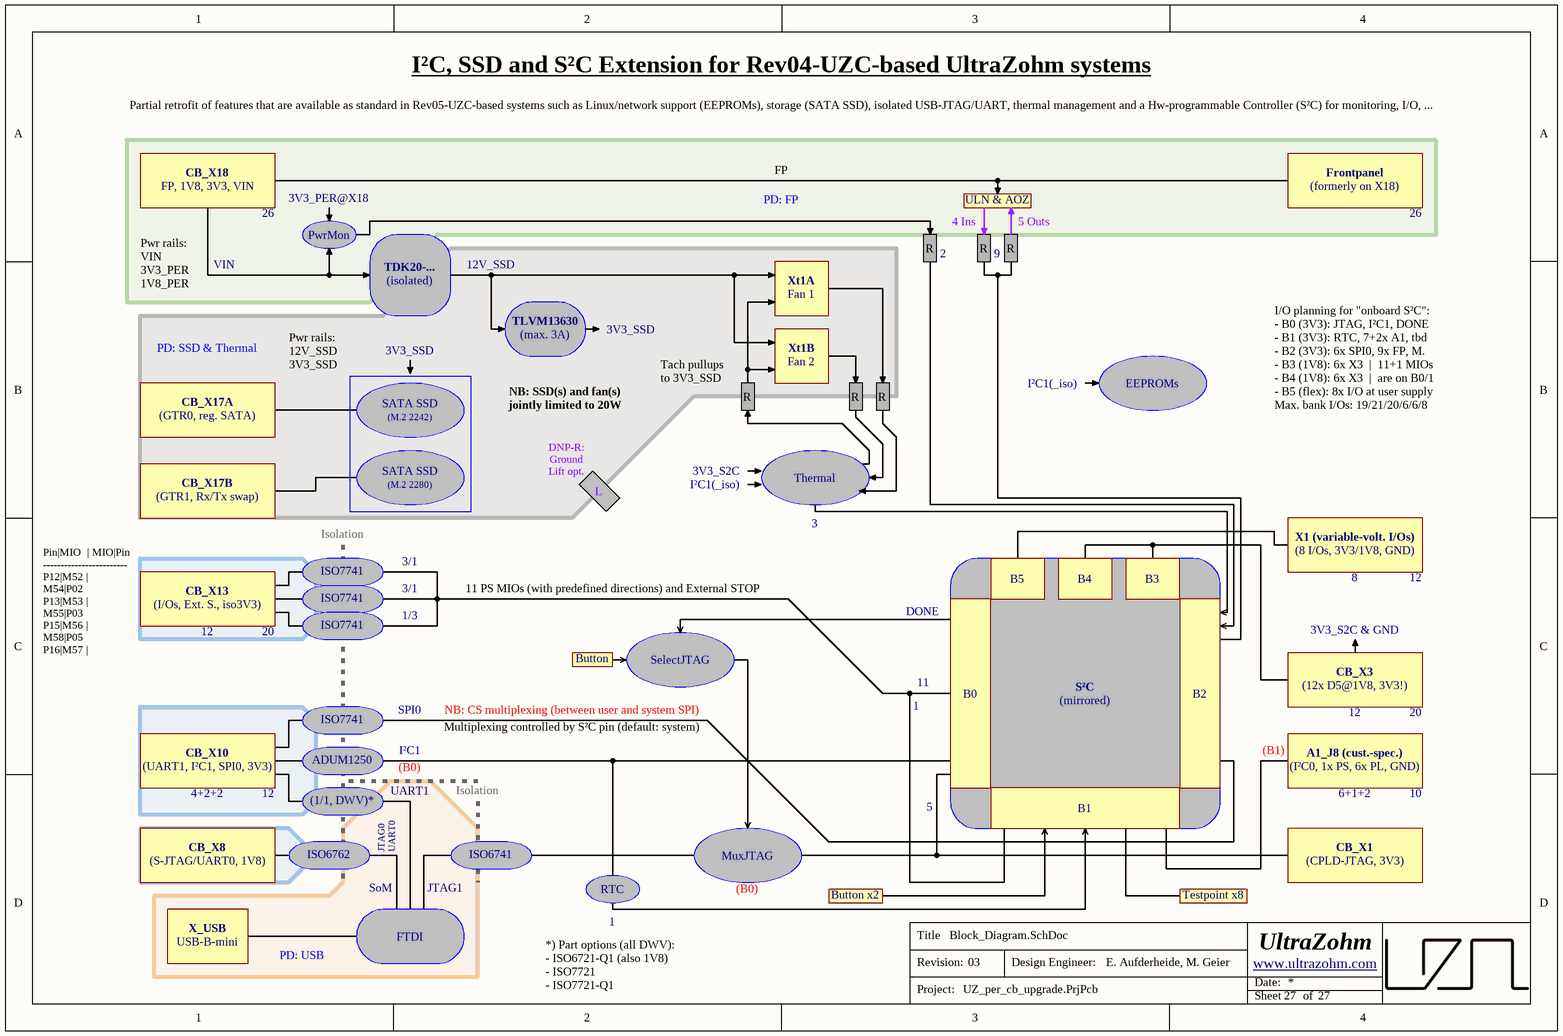
[diagram p6: Block_Diagram.SchDoc]

### Notes on the sheet
- I²C, SSD and S²C Extension for Rev04-UZC-based UltraZohm systems
- Partial retrofit of features that are available as standard in Rev05-UZC-based systems such as Linux/network support (EEPROMs), storage (SATA SSD), isolated USB-JTAG/UART, thermal management and a Hw-programmable Controller (S²C) for monitoring, I/O, ...
- CB_X18
- FP
- Frontpanel
- FP, 1V8, 3V3, VIN
- 26
- PwrMon
- 3V3_PER@X18
- PD: FP
- R
- 4 Ins
- ULN & AOZ
- 5 Outs
- (formerly on X18)
- Pwr rails:
  VIN
  3V3_PER
  1V8_PER
- VIN
- (isolated)
- TDK20-...
- 12V_SSD
- Xt1A
- Fan 1
- 2
- 9
- PD: SSD & Thermal
- Pwr rails:
  12V_SSD
  3V3_SSD
- 3V3_SSD
- TLVM13630
- (max. 3A)
- Tach pullups to 3V3_SSD
- Xt1B
- Fan 2
- I²C1(_iso)
- EEPROMs
- CB_X17A
- (GTR0, reg. SATA)
- SATA SSD
- (M.2 2242)
- NB: SSD(s) and fan(s) jointly limited to 20W
- I/O planning for "onboard S²C":
  - B0 (3V3): JTAG, I²C1, DONE
  - B1 (3V3): RTC, 7+2x A1, tbd
  - B2 (3V3): 6x SPI0, 9x FP, M.
  - B3 (1V8): 6x X3  |  11+1 MIOs
  - B4 (1V8): 6x X3  |  are on B0/1
  - B5 (flex): 8x I/O at user supply
  Max. bank I/Os: 19/21/20/6/6/8
- CB_X17B
- (GTR1, Rx/Tx swap)
- (M.2 2280)
- DNP-R: Ground Lift opt.
- L
- 3V3_S2C
- Thermal
- ISO7741
- Isolation
- 3/1
- 3
- B5
- B4
- B3
- X1 (variable-volt. I/Os)
- (8 I/Os, 3V3/1V8, GND)
- 8
- 12
- Pin|MIO  | MIO|Pin
  ------------------------
  P12|M52 | M54|P02
  P13|M53 | M55|P03
  P15|M56 | M58|P05
  P16|M57 | M59|P06
  P18|M60 | M62|P08
  P19|M61 | !ES!|P09
  6x In    |  5xO 1xI
- CB_X13
- (I/Os, Ext. S., iso3V3)
- 20
- 1/3
- 11 PS MIOs (with predefined directions) and External STOP
- SelectJTAG
- DONE
- 3V3_S2C & GND
- SPI0
- NB: CS multiplexing (between user and system SPI)
- Button
- 1
- 11
- B0
- S²C
- (mirrored)
- B2
- CB_X3
- (12x D5@1V8, 3V3!)
- CB_X10
- (UART1, I²C1, SPI0, 3V3)
- ADUM1250
- I²C1
- (B0)
- Multiplexing controlled by S²C pin (default: system)
- (B1)
- A1_J8 (cust.-spec.)
- (I²C0, 1x PS, 6x PL, GND)
- CB_X8
- 4+2+2
- (1/1, DWV)*
- JTAG0
- UART0
- UART1
- MuxJTAG
- 5
- B1
- CB_X1
- 6+1+2
- 10
- (S-JTAG/UART0, 1V8)
- ISO6762
- SoM
- JTAG1
- ISO6741
- RTC
- Button x2
- Testpoint x8
- (CPLD-JTAG, 3V3)
- X_USB
- USB-B-mini
- PD: USB
- FTDI
- *) Part options (all DWV):
  - ISO6721-Q1 (also 1V8)
  - ISO7721
  - ISO7721-Q1
- Title
- Revision:
- Design Engineer:
- Date:
- Project:
- Sheet
- of

## Sheet Power_Supplies.SchDoc
size A4; SheetNumber: 7
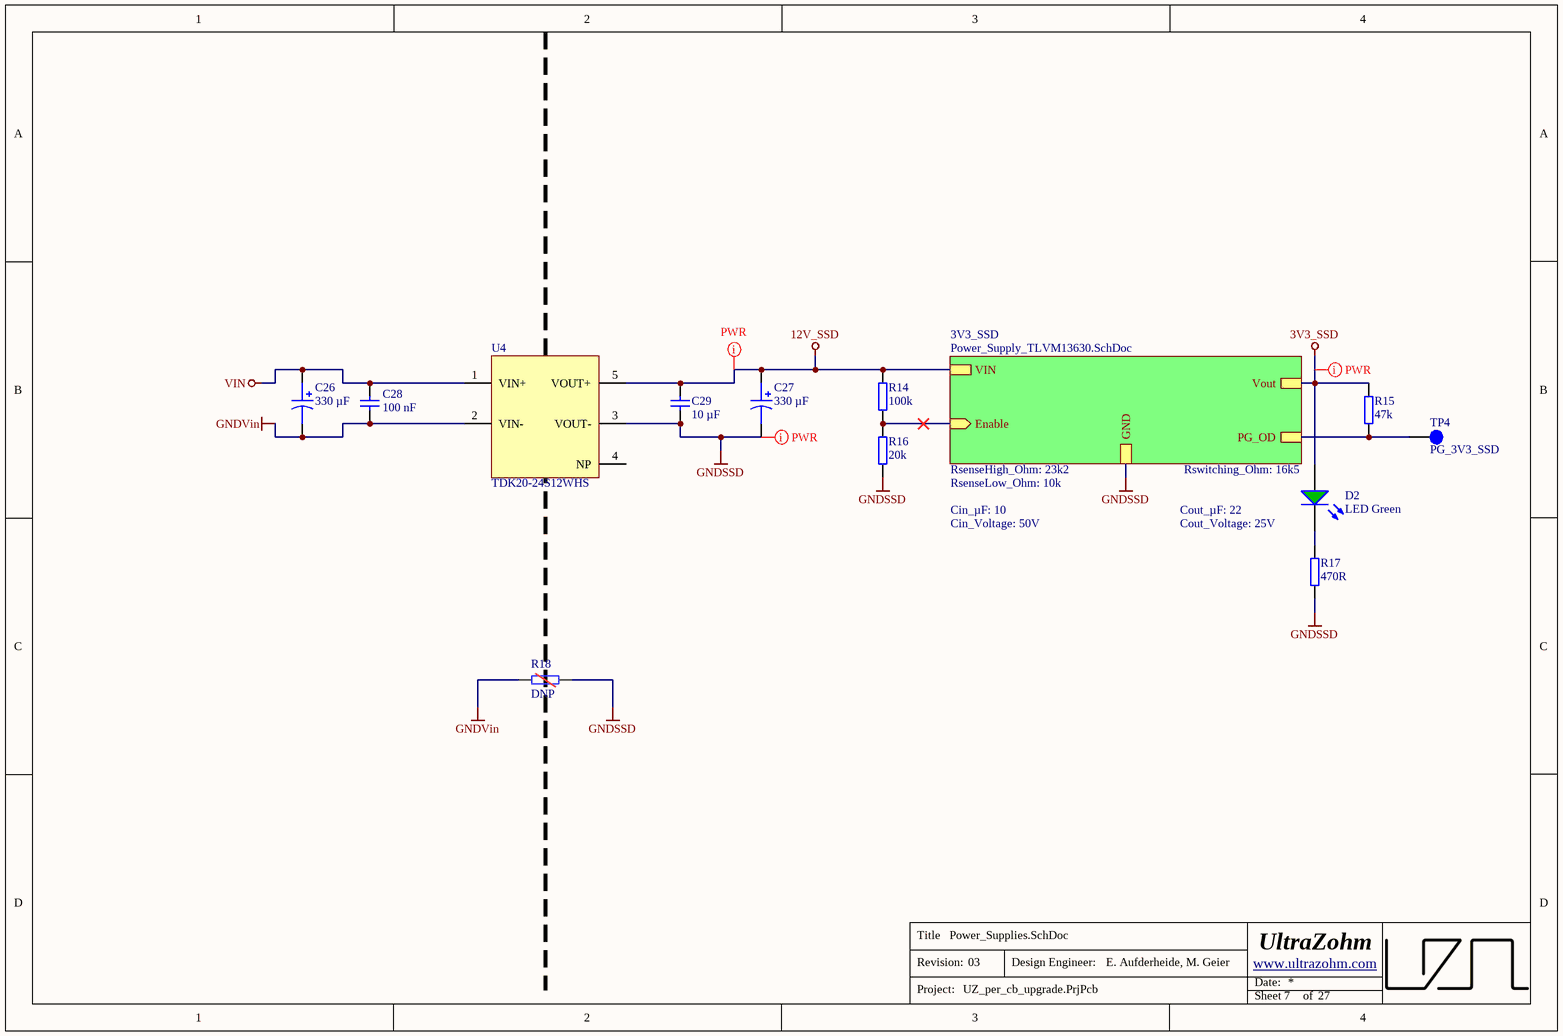
[diagram p7: Power_Supplies.SchDoc]

### Parts
C26  330 µF  [SM_RADIAL_10mm]
C27  330 µF  [SM_RADIAL_10mm]
C28  100 nF  [C_0603_TE]
C29  10 µF  [C_1206_TE]
D2  LED Green  [WL-SMCW_0603]
R14  100k  [R_0603_TE]
R15  47k  [R_0603_TE]
R16  20k  [R_0603_TE]
R17  470R  [R_0603_TE]
R18  DNP  [R_1206_TE-DNP]  (no BOM)
TP4  PG_3V3_SSD  [TP_1mm]  (no BOM)
U4  TDK20-24S12WHS  [TDKxx-yySzzS_25.4x25.4]

### Sub-sheets
3V3_SSD = Power_Supply_TLVM13630.SchDoc (file not in this document): Vout, Enable (in), VIN, GND, PG_OD  | RsenseHigh_Ohm: 23k2; RsenseLow_Ohm: 10k; Rswitching_Ohm: 16k5; Cin_µF: 10; Cin_Voltage: 50V; Cin_Technology: X7R; Cout_µF: 22; Cout_Voltage: 25V; Cout_Technology: X7R; SubSheet_SheetNumber: 8; Output_V: 3.3

### Nets
3V3_SSD: D2.2(A) R15.1 ; sheet 3V3_SSD/Vout
12V_SSD: C27.1 C29.2 R14.2 U4.5(VOUT+) ; sheet 3V3_SSD/VIN
GNDSSD: C27.2 C29.1 R16.1 R17.1 R18.1 U4.3(VOUT-) ; sheet 3V3_SSD/GND
GNDVin: C26.2 C28.2 R18.2 U4.2(VIN-)
VIN: C26.1 C28.1 U4.1(VIN+)
NetD2_1: D2.1(K) R17.2
NetR14_1: R14.1 R16.2 ; sheet 3V3_SSD/Enable
NetR15_2: R15.2 TP4.1 ; sheet 3V3_SSD/PG_OD

Not connected (* = marked no-connect by the designer): U4 4(NP)

### Layout directives
net class PWR: 3V3_SSD, 12V_SSD, GNDSSD

### Notes on the sheet
- Title
- Revision:
- Design Engineer:
- Date:
- Project:
- Sheet
- of

### Library data of the parts
C26 C27 = EEEFT1H331GP: Aluminium Electrolytic Capacitors - SMD 330uF 50V; Manufacturer: Panasonic; Tolerance: 20 %; Voltage Rating: 50 VDC; Created from: FRosner; Manufacturer Part Number: EEEFT1H331GP; PartID: 163; Created On: 05/09/2024 09:08:02; ComponentLink1Description: Datasheet; ComponentLink1URL: https://www.mouser.de/datasheet/2/315/ABA0000C1240-1130326.pdf; Component Type: Aluminium Electrolytic; Device Package: 10 mm; Last Updated: 19/02/2025 08:53:22; Mounting Type: SMD; Operating Temperature: -55 to +105°C; Series: FT; Supplier 1: Mouser; Supplier Part Number 1: 667-EEE-FT1H331GP; Supplier 2: LCSC; Supplier Part Number 2: C542207; Type: Capacitor; Value: 330 µF; Live Cycle Status: 1; LCSC Part Number: C542207
C28 = UZgen_C_0603_100nF_50V_X7R: as C3 on sheet Samtec_Connectors; Technology: X7R; Value: 100 nF; Manufacturer Part Number: UZgen_C_0603_100nF_50V_X7R; PartID: 1; Created On: 02/07/2024 14:42:23; Device Package: 0603; Mounting Type: SMD; Last Updated: 08/08/2024 15:01:15
C29 = UZgen_C_1206_10uF_50V_X7R: Generic capacitor; Manufacturer: UZgen; Tolerance: 10 %; Created from: MGeier; Voltage: 50V; Manufacturer Part Number: UZgen_C_1206_10uF_50V_X7R; PartID: 5807; Created On: 20/03/2025 14:05:00; Device Package: 1206; Last Updated: 20/03/2025 14:05:00; Mounting Type: SMD; Value: 10 µF; Technology: X7R
D2 = UZgen_LED_0603_Green: as D1 on sheet Samtec_Connectors; Manufacturer Part Number: UZgen_LED_0603_Green; PartID: 21; Created On: 09/09/2024 10:45:01; ComponentLink1Description: N/A; ComponentLink1URL: N/A; Component Type: LED Diode; Device Package: 0603; Last Updated: 09/09/2024 10:45:01; Mounting Type: SMD; Supplier 1: LCSC; Supplier Part Number 1: =LCSC Part Number; Type: Standard; Value: LED Green; Live Cycle Status: 1; Stock number: not stored; Color: green
R14 = UZgen_R_0603_100k: Generic resistor; Manufacturer: UZgen; Tolerance: 1 %; Created from: UZgenTool; Manufacturer Part Number: UZgen_R_0603_100k; PartID: 268; Created On: 02/07/2024 17:29:50; Value: 100k; Device Package: 0603; Mounting Type: SMD; Last Updated: 02/07/2024 17:29:50
R15 = UZgen_R_0603_47k: Generic resistor; Manufacturer: UZgen; Tolerance: 1 %; Created from: UZgenTool; Manufacturer Part Number: UZgen_R_0603_47k; PartID: 260; Created On: 02/07/2024 17:29:50; Value: 47k; Device Package: 0603; Mounting Type: SMD; Last Updated: 02/07/2024 17:29:50
R16 = UZgen_R_0603_20k: Generic resistor; Manufacturer: UZgen; Tolerance: 1 %; Created from: UZgenTool; Manufacturer Part Number: UZgen_R_0603_20k; PartID: 251; Created On: 02/07/2024 17:29:50; Value: 20k; Device Package: 0603; Mounting Type: SMD; Last Updated: 02/07/2024 17:29:50
R17 = UZgen_R_0603_470R: as R8 on sheet Samtec_Connectors; Manufacturer Part Number: UZgen_R_0603_470R; PartID: 213; Created On: 02/07/2024 17:29:49; Value: 470R; Device Package: 0603; Mounting Type: SMD; Last Updated: 02/07/2024 17:29:49
R18 = UZgen_R_1206_DNP: as R1 on sheet Top_sheet; Manufacturer Part Number: UZgen_R_1206_DNP; PartID: 595; Created On: 25/03/2025 14:26:15; Value: DNP; Device Package: 1206; Tolerance: -; Mounting Type: SMD; Last Updated: 02/04/2025 19:05:00
TP4 = NULL: as TP1 on sheet RTC; Created: 2018_06_25_AGeiger; Value: PG_3V3_SSD; PartID: 9; Created On: 20/09/2022 13:14:57; Component Type: Testpoint; Last Updated: 20/09/2022 13:15:39; Manufacturer: NULL; Supplier 1: NULL; Supplier Part Number 1: NULL; Type: Testpoint; Live Cycle Status: 1
U4 = TDK20-24S12WHS: 9-36V to 12V 1.67A / Plugin,25.4x25.4mm Isolated Power Modules ROHS; Manufacturer: TDPOWER; Created from: MGeier; Manufacturer Part Number: TDK20-24S12WHS; PartID: 12; Created On: 24/02/2025 16:03:45; ComponentLink1Description: Datasheet; ComponentLink1URL: https://wmsc.lcsc.com/wmsc/upload/file/pdf/v2/lcsc/2403202025_TDPOWER-TDK20-24S12WHS_C7494352.pdf; Component Type: Isolated DC/DC; Device Package: 25.4x25.4mm²; Last Updated: 24/02/2025 16:03:45; Mounting Type: THT; Operating Temperature: -40 - 85 °C; Supplier 1: LCSC; Supplier Part Number 1: C7494352; Type: Isolated DC/DC; Live Cycle Status: 1; LCSC Part Number: C7494352; Stock number: not stored